# Altium schematic sheet Public_CPU_IO.SchDoc
size D
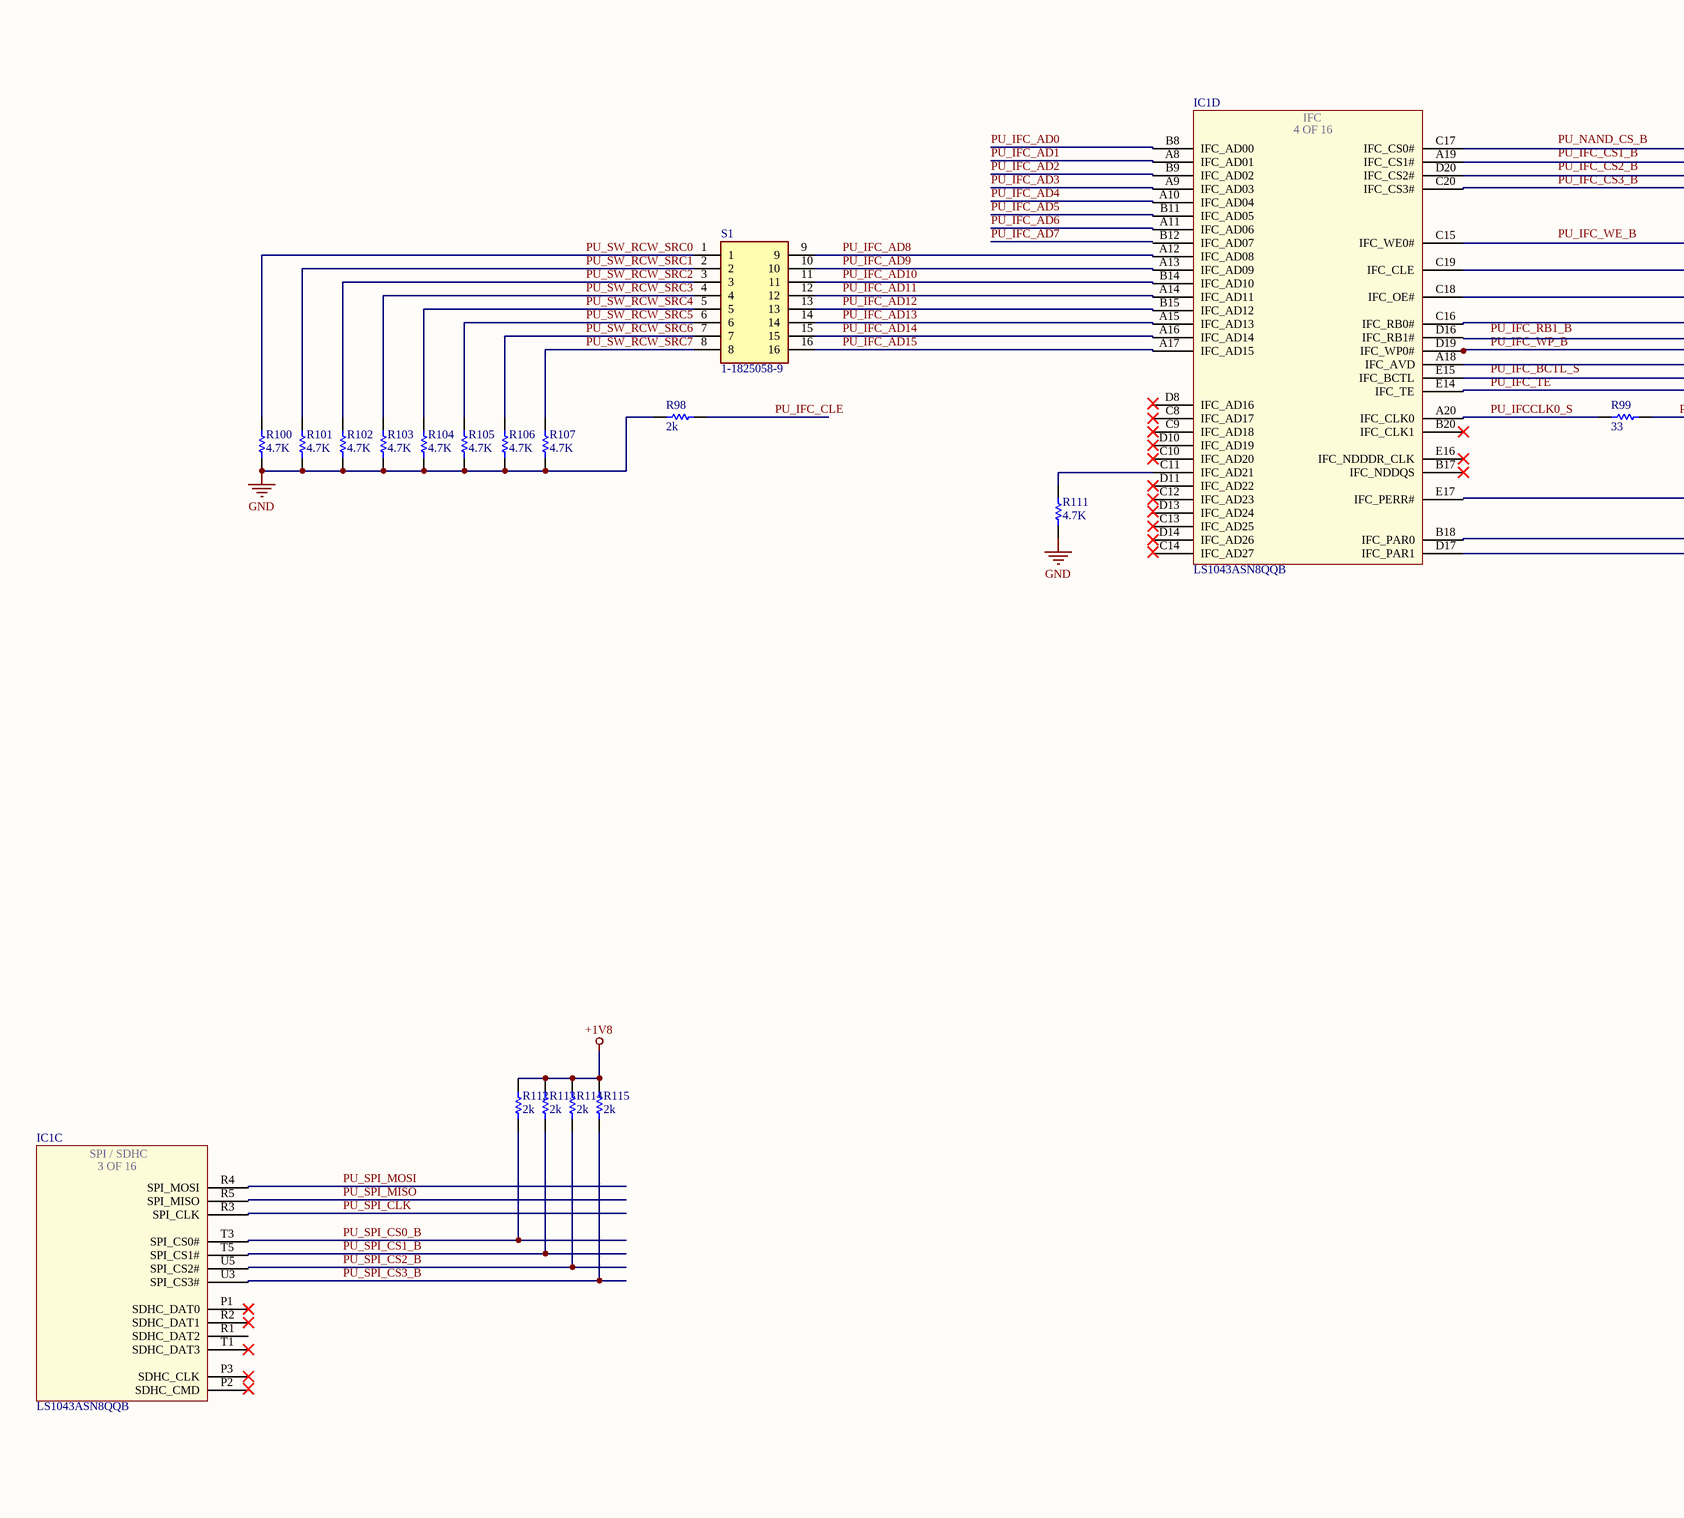
[diagram p0: Public_CPU_IO.SchDoc, left]
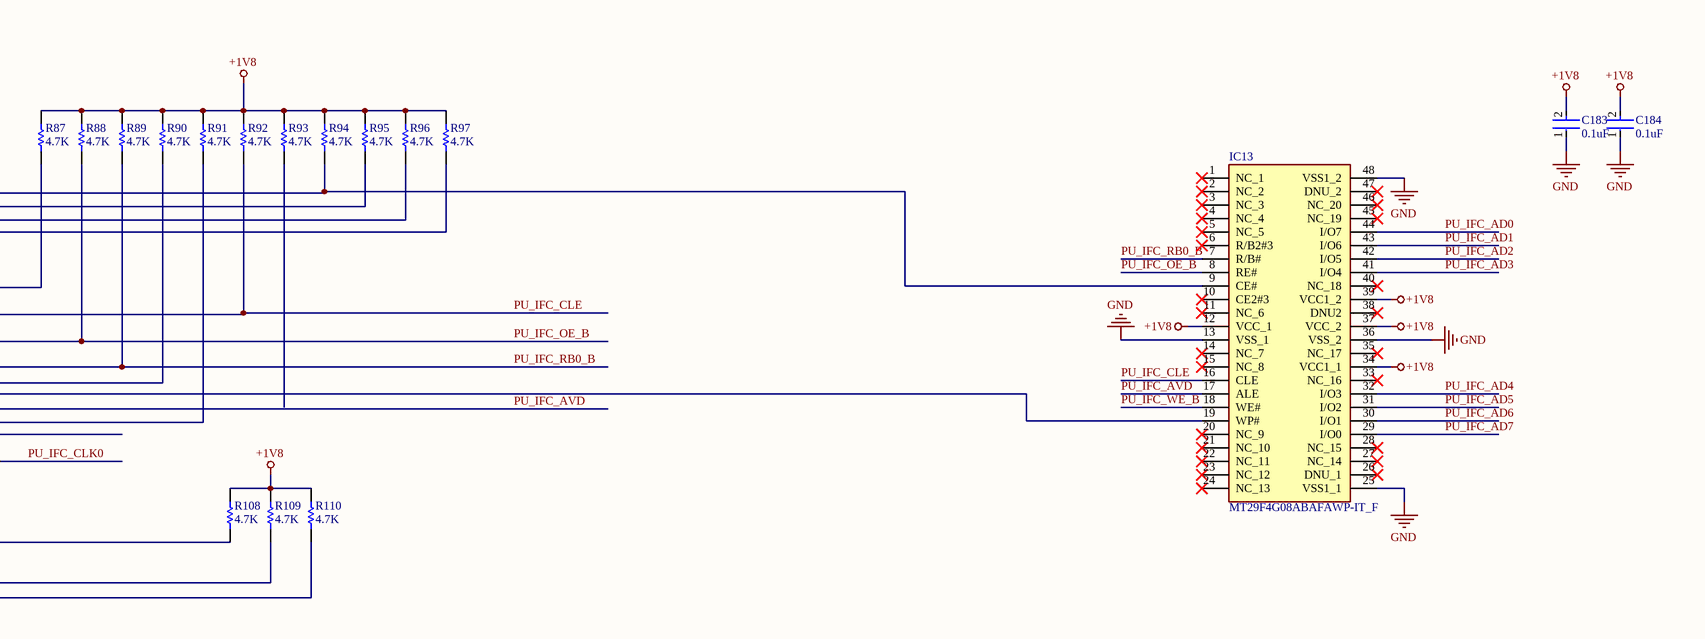
[diagram p1: Public_CPU_IO.SchDoc, right]

## Parts
C183  0.1uF  [FP-GRM15-MFG]
C184  0.1uF  [FP-GRM15-MFG]
IC1  LS1043ASN8QQB  [BGA780C80P28X28_2300X2300X261]  (parts C,D of 16)
IC13  MT29F4G08ABAFAWP-IT_F  [SOP50P2000X120-48N]
R87  4.7K  [RESC1005X40X25LL05T05]
R88  4.7K  [RESC1005X40X25LL05T05]
R89  4.7K  [RESC1005X40X25LL05T05]
R90  4.7K  [RESC1005X40X25LL05T05]
R91  4.7K  [RESC1005X40X25LL05T05]
R92  4.7K  [RESC1005X40X25LL05T05]
R93  4.7K  [RESC1005X40X25LL05T05]
R94  4.7K  [RESC1005X40X25LL05T05]
R95  4.7K  [RESC1005X40X25LL05T05]
R96  4.7K  [RESC1005X40X25LL05T05]
R97  4.7K  [RESC1005X40X25LL05T05]
R98  2k  [RESC1005X40X25NL05T05]
R99  33  [RESC1005X40X25LL05T05]
R100  4.7K  [RESC1005X40X25LL05T05]
R101  4.7K  [RESC1005X40X25LL05T05]
R102  4.7K  [RESC1005X40X25LL05T05]
R103  4.7K  [RESC1005X40X25LL05T05]
R104  4.7K  [RESC1005X40X25LL05T05]
R105  4.7K  [RESC1005X40X25LL05T05]
R106  4.7K  [RESC1005X40X25LL05T05]
R107  4.7K  [RESC1005X40X25LL05T05]
R108  4.7K  [RESC1005X40X25LL05T05]
R109  4.7K  [RESC1005X40X25LL05T05]
R110  4.7K  [RESC1005X40X25LL05T05]
R111  4.7K  [RESC1005X40X25LL05T05]
R112  2k  [RESC1005X40X25NL05T05]
R113  2k  [RESC1005X40X25NL05T05]
R114  2k  [RESC1005X40X25NL05T05]
R115  2k  [RESC1005X40X25NL05T05]
S1  1-1825058-9  [118250589]

## Nets
+1V8: C183.2 C184.2 IC13.12(VCC_1) IC13.34(VCC1_1) IC13.37(VCC_2) IC13.39(VCC1_2) R87.2 R88.2 R89.2 R90.2 R91.2 R92.2 R93.2 R94.2 R95.2 R96.2 R97.2 R108.2 R109.2 R110.2 R112.1 R113.1 R114.1 R115.1
GND: C183.1 C184.1 IC13.13(VSS_1) IC13.25(VSS1_1) IC13.36(VSS_2) IC13.48(VSS1_2) R98.2 R100.1 R101.1 R102.1 R103.1 R104.1 R105.1 R106.1 R107.1 R111.1
PU_IFC_AD0: IC1.B8(IFC_AD00) IC13.44(I/O7)
PU_IFC_AD1: IC1.A8(IFC_AD01) IC13.43(I/O6)
PU_IFC_AD2: IC1.B9(IFC_AD02) IC13.42(I/O5)
PU_IFC_AD3: IC1.A9(IFC_AD03) IC13.41(I/O4)
PU_IFC_AD4: IC1.A10(IFC_AD04) IC13.32(I/O3)
PU_IFC_AD5: IC1.B11(IFC_AD05) IC13.31(I/O2)
PU_IFC_AD6: IC1.A11(IFC_AD06) IC13.30(I/O1)
PU_IFC_AD7: IC13.29(I/O0)
PU_IFC_AD8: IC1.A12(IFC_AD08) S1.9
PU_IFC_AD9: IC1.A13(IFC_AD09) S1.10
PU_IFC_AD10: IC1.B14(IFC_AD10) S1.11
PU_IFC_AD11: IC1.A14(IFC_AD11) S1.12
PU_IFC_AD12: IC1.B15(IFC_AD12) S1.13
PU_IFC_AD13: IC1.A15(IFC_AD13) S1.14
PU_IFC_AD14: IC1.A16(IFC_AD14) S1.15
PU_IFC_AD15: IC1.A17(IFC_AD15) S1.16
PU_IFC_AVD: IC1.A18(IFC_AVD) IC13.17(ALE)
PU_IFC_CLE: IC1.C19(IFC_CLE) IC13.16(CLE) R92.1 R98.1
PU_IFC_CLK0: R99.2
PU_IFC_CS3_B: IC1.C20(IFC_CS3#) R97.1
PU_IFC_OE_B: IC1.C18(IFC_OE#) IC13.8(RE#) R88.1
PU_IFC_RB0_B: IC1.C16(IFC_RB0#) IC13.7(R/B#) R89.1
PU_IFC_TE: IC1.E14(IFC_TE)
PU_IFC_WE_B: IC13.18(WE#)
PU_IFC_WP_B: IC1.D19(IFC_WP0#) IC13.19(WP#)
PU_IFCCLK0_S: IC1.A20(IFC_CLK0) R99.1
PU_SPI_CLK: IC1.R3(SPI_CLK)
PU_SPI_CS0_B: IC1.T3(SPI_CS0#) R112.2
PU_SPI_CS1_B: IC1.T5(SPI_CS1#) R113.2
PU_SPI_CS2_B: R114.2
PU_SPI_CS3_B: IC1.U3(SPI_CS3#) R115.2
PU_SPI_MOSI: IC1.R4(SPI_MOSI)
PU_SW_RCW_SRC0: R100.2 S1.1
PU_SW_RCW_SRC1: R101.2 S1.2
PU_SW_RCW_SRC2: R102.2 S1.3
PU_SW_RCW_SRC3: R103.2 S1.4
PU_SW_RCW_SRC4: R104.2 S1.5
PU_SW_RCW_SRC5: R105.2 S1.6
PU_SW_RCW_SRC6: R106.2 S1.7
PU_SW_RCW_SRC7: R107.2 S1.8
NetIC1_A19: IC1.A19(IFC_CS1#) R95.1
NetIC1_B18: IC1.B18(IFC_PAR0) R109.1
NetIC1_C11: IC1.C11(IFC_AD21) R111.2
NetIC1_C15: IC1.C15(IFC_WE0#) R87.1
NetIC1_C17: IC1.C17(IFC_CS0#) IC13.9(CE#) R94.1
NetIC1_D17: IC1.D17(IFC_PAR1) R110.1
NetIC1_D20: IC1.D20(IFC_CS2#) R96.1
NetIC1_E15: IC1.E15(IFC_BCTL) R91.1

Not connected (* = marked no-connect by the designer): IC1 B12(IFC_AD07) B17(IFC_NDDQS)* B20(IFC_CLK1)* C8(IFC_AD17)* C9(IFC_AD18)* C10(IFC_AD20)* C12(IFC_AD23)* C13(IFC_AD25)* C14(IFC_AD27) D8(IFC_AD16) D10(IFC_AD19)* D11(IFC_AD22)* D13(IFC_AD24) D14(IFC_AD26)* D16(IFC_RB1#) E16(IFC_NDDDR_CLK)* E17(IFC_PERR#) P1(SDHC_DAT0)* P2(SDHC_CMD) P3(SDHC_CLK)* R1(SDHC_DAT2) R2(SDHC_DAT1)* R5(SPI_MISO) T1(SDHC_DAT3)* U5(SPI_CS2#); IC13 1(NC_1)* 2(NC_2)* 3(NC_3)* 4(NC_4)* 5(NC_5)* 6(R/B2#3)* 10(CE2#3)* 11(NC_6)* 14(NC_7)* 15(NC_8)* 20(NC_9)* 21(NC_10)* 22(NC_11)* 23(NC_12)* 24(NC_13)* 26(DNU_1)* 27(NC_14)* 28(NC_15)* 33(NC_16)* 35(NC_17)* 38(DNU2)* 40(NC_18)* 45(NC_19)* 46(NC_20)* 47(DNU_2)*; R90 1; R93 1; R108 1

## Notes on the sheet
- Labels drawn without touching a wire or pin: PU_IFC_BCTL_S, PU_IFC_CS1_B, PU_IFC_CS2_B, PU_IFC_RB1_B, PU_IFC_WE_B, PU_NAND_CS_B
- Title
- Size:
- Date:
- File:
- D
- Number:
- Time:
- Revision:
- Sheet
- of
- (in symbol LS1043ASN8QQB, part C) SPI / SDHC; 3 OF 16
- (in symbol LS1043ASN8QQB, part D) IFC; 4 OF 16

## Library data of the parts
C183 C184 = CMP-2100-03641-2: CAP CER 0.1UF 16V X7R 0402; Manufacturer Part Number: GRM155R71C104KA88D; Manufacturer: Murata; Standoff Height: 0mm; Tolerance: 10%; Voltage Rating: 16Vdc; Material: Ceramic; Capacitance: 0.10μF; Value: 0.10μF; RoHS: TRUE; Temperature Characteristic: X7R; Octopart: https://octopart.com/grm155r71c104ka88d-murata-196880; Digikey Description: CAP CER 0.1UF 16V X7R 0402; Device Class L3: Ceramic Capacitors; Height: 0.55mm; ComponentLink2Description: Datasheet; Temperature Range Low: -55°C; Ipc Land Pattern Name: CAPC10050X219; ComponentLink2URL: https://search.murata.co.jp/Ceramy/image/img/A01X/G101/ENG/GRM155R71H471KA01-01A.pdf; Device Class L1: Passive Components; Lead Free: yes; Category: Cap; Package: GRM15; Temperature: -55°C to +125°C; Device Class L2: Capacitors; Temperature Range High: +125°C; Mouser Description: 0402 0.1 uF 16V ±10 % Tolerance X7R SMT Multilayer Ceramic Capacitor
IC1 = LS1043ASN8QQB: Integrated Circuit; Manufacturer_Name: NXP; Datasheet Link: http://www.nxp.com/secured/assets/documents/en/data-sheet/LS1088A.pdf; Height: 2.61mm; Manufacturer_Part_Number: LS1043ASN8QQB; Mouser Part Number: 771-LS1043ASN8QQB; Mouser Price/Stock: https://www.mouser.co.uk/ProductDetail/NXP-Semiconductors/LS1043ASN8QQB/?qs=AQlKX63v8RsTATOTx7X0Jg%3D%3D
IC13 = MT29F4G08ABAFAWP-IT_F: Integrated Circuit; Manufacturer_Name: Micron; Manufacturer_Part_Number: MT29F4G08ABAFAWP-IT:F; Datasheet Link: https://componentsearchengine.com/Datasheets/2/MT29F4G08ABAFAWP-IT_F.pdf; Height: 1.2mm; Mouser Part Number: 340-371016-TRAY; Mouser Price/Stock: https://www.mouser.co.uk/ProductDetail/Micron/MT29F4G08ABAFAWP-ITF/?qs=0lSvoLzn4L9J4k7jmg5qkQ%3D%3D; Arrow Part Number: MT29F4G08ABAFAWP-IT:F; Arrow Price/Stock: https://www.arrow.com/en/products/mt29f4g08abafawp-itf/micron-technology
R87-R97 R100-R111 = CMP-2002-01154-4: Chip Resistor, 4.7 KOhm, +/- 1%, 0.1 W, -55 to 155 degC, 0402 (1005 Metric), RoHS, Tape and Reel; PartNumber: ERJ-2RKF4701X; Voltage Rating: 50 V; Case\/Package: 0402; Power Rating: 100 mW; Height: 0.35 mm; Mounting Technology: Surface Mount; REACH SVHC: Yes; Resistance: 4.7 KOhm; Max Operating Temperature: 155 degC; ComponentLink1Description: Manufacturer URL; ComponentLink2Description: Datasheet; Pins: 2; PackageReference: 0402; Tolerance: 1%; Case Code (Imperial): 0402; Length: 1 mm; PackageDescription: 2-Pin Surface Mount Device, Body 1 x 0.5 mm; RoHSCompliant: true; Package Quantity: 1; Radiation Hardening: No; DatasheetVersion: 04/2015; Width: 0.5 mm; Case Code (Metric): 1005; Mount: Surface Mount; ComponentLink1URL: http://www.panasonic.com/; Min Operating Temperature: -55 degC; Packaging: Cut Tape; ComponentLink2URL: http://industrial.panasonic.com/cdbs/www-data/pdf/RDA0000/AOA0000C86.pdf
R98 R112-R115 = CMP-2002-00758-3: Chip Resistor, 2 KOhm, +/- 1%, 100 mW, -55 to 155 degC, 0402 (1005 Metric), RoHS, Tape and Reel; Manufacturer: Basic Passives; PartNumber: ERJ-2RKF2001X; Power Rating: 100 mW; Voltage Rating: 50 V; Case\/Package: 0402; Resistance: 2 KOhm; Packaging: Tape and Reel; Tolerance: 1%; PackageReference: 0402; Package Quantity: 10000; ComponentLink1URL: http://www.panasonic.com/; Min Operating Temperature: -55 degC; DatasheetVersion: 04/2015; Case Code (Imperial): 0402; PackageDescription: 2-Pin Surface Mount Device, Body 1 x 0.5 mm; Height: 0.35 mm; Pins: 2; Mount: Surface Mount; Radiation Hardening: No; ComponentLink1Description: Manufacturer URL; ComponentLink2Description: Datasheet; Max Operating Temperature: 155 degC; Case Code (Metric): 1005; Length: 1 mm; RoHSCompliant: true; Mounting Technology: Surface Mount; Width: 0.5 mm; ComponentLink2URL: http://industrial.panasonic.com/cdbs/www-data/pdf/RDA0000/AOA0000C86.pdf; REACH SVHC: Unknown
R99 = CMP-2002-01146-1: Manufacturer: Panasonic; Part Number: ERJ2RKF33R0X
S1 = 1-1825058-9: Switch; Manufacturer_Name: TE Connectivity; Datasheet Link: http://www.te.com/commerce/DocumentDelivery/DDEController?Action=showdoc&DocId=Customer+Drawing%7F1825058%7FS4%7Fpdf%7FEnglish%7FENG_CD_1825058_S4.pdf%7F1-1825058-9; Height: 3mm; Manufacturer_Part_Number: 1-1825058-9; Arrow Part Number: 1-1825058-9; Arrow Price/Stock: https://www.arrow.com/en/products/1-1825058-9/te-connectivity